# EasyEDA schematic 1-Schematic_Automatic watering v1.1.json
TITLE: Automatic Watering; REV: 1.1; Date: 2019-08-14; Sheet: 1/1; Drawn By: Tomáš Filo; Company: DIY
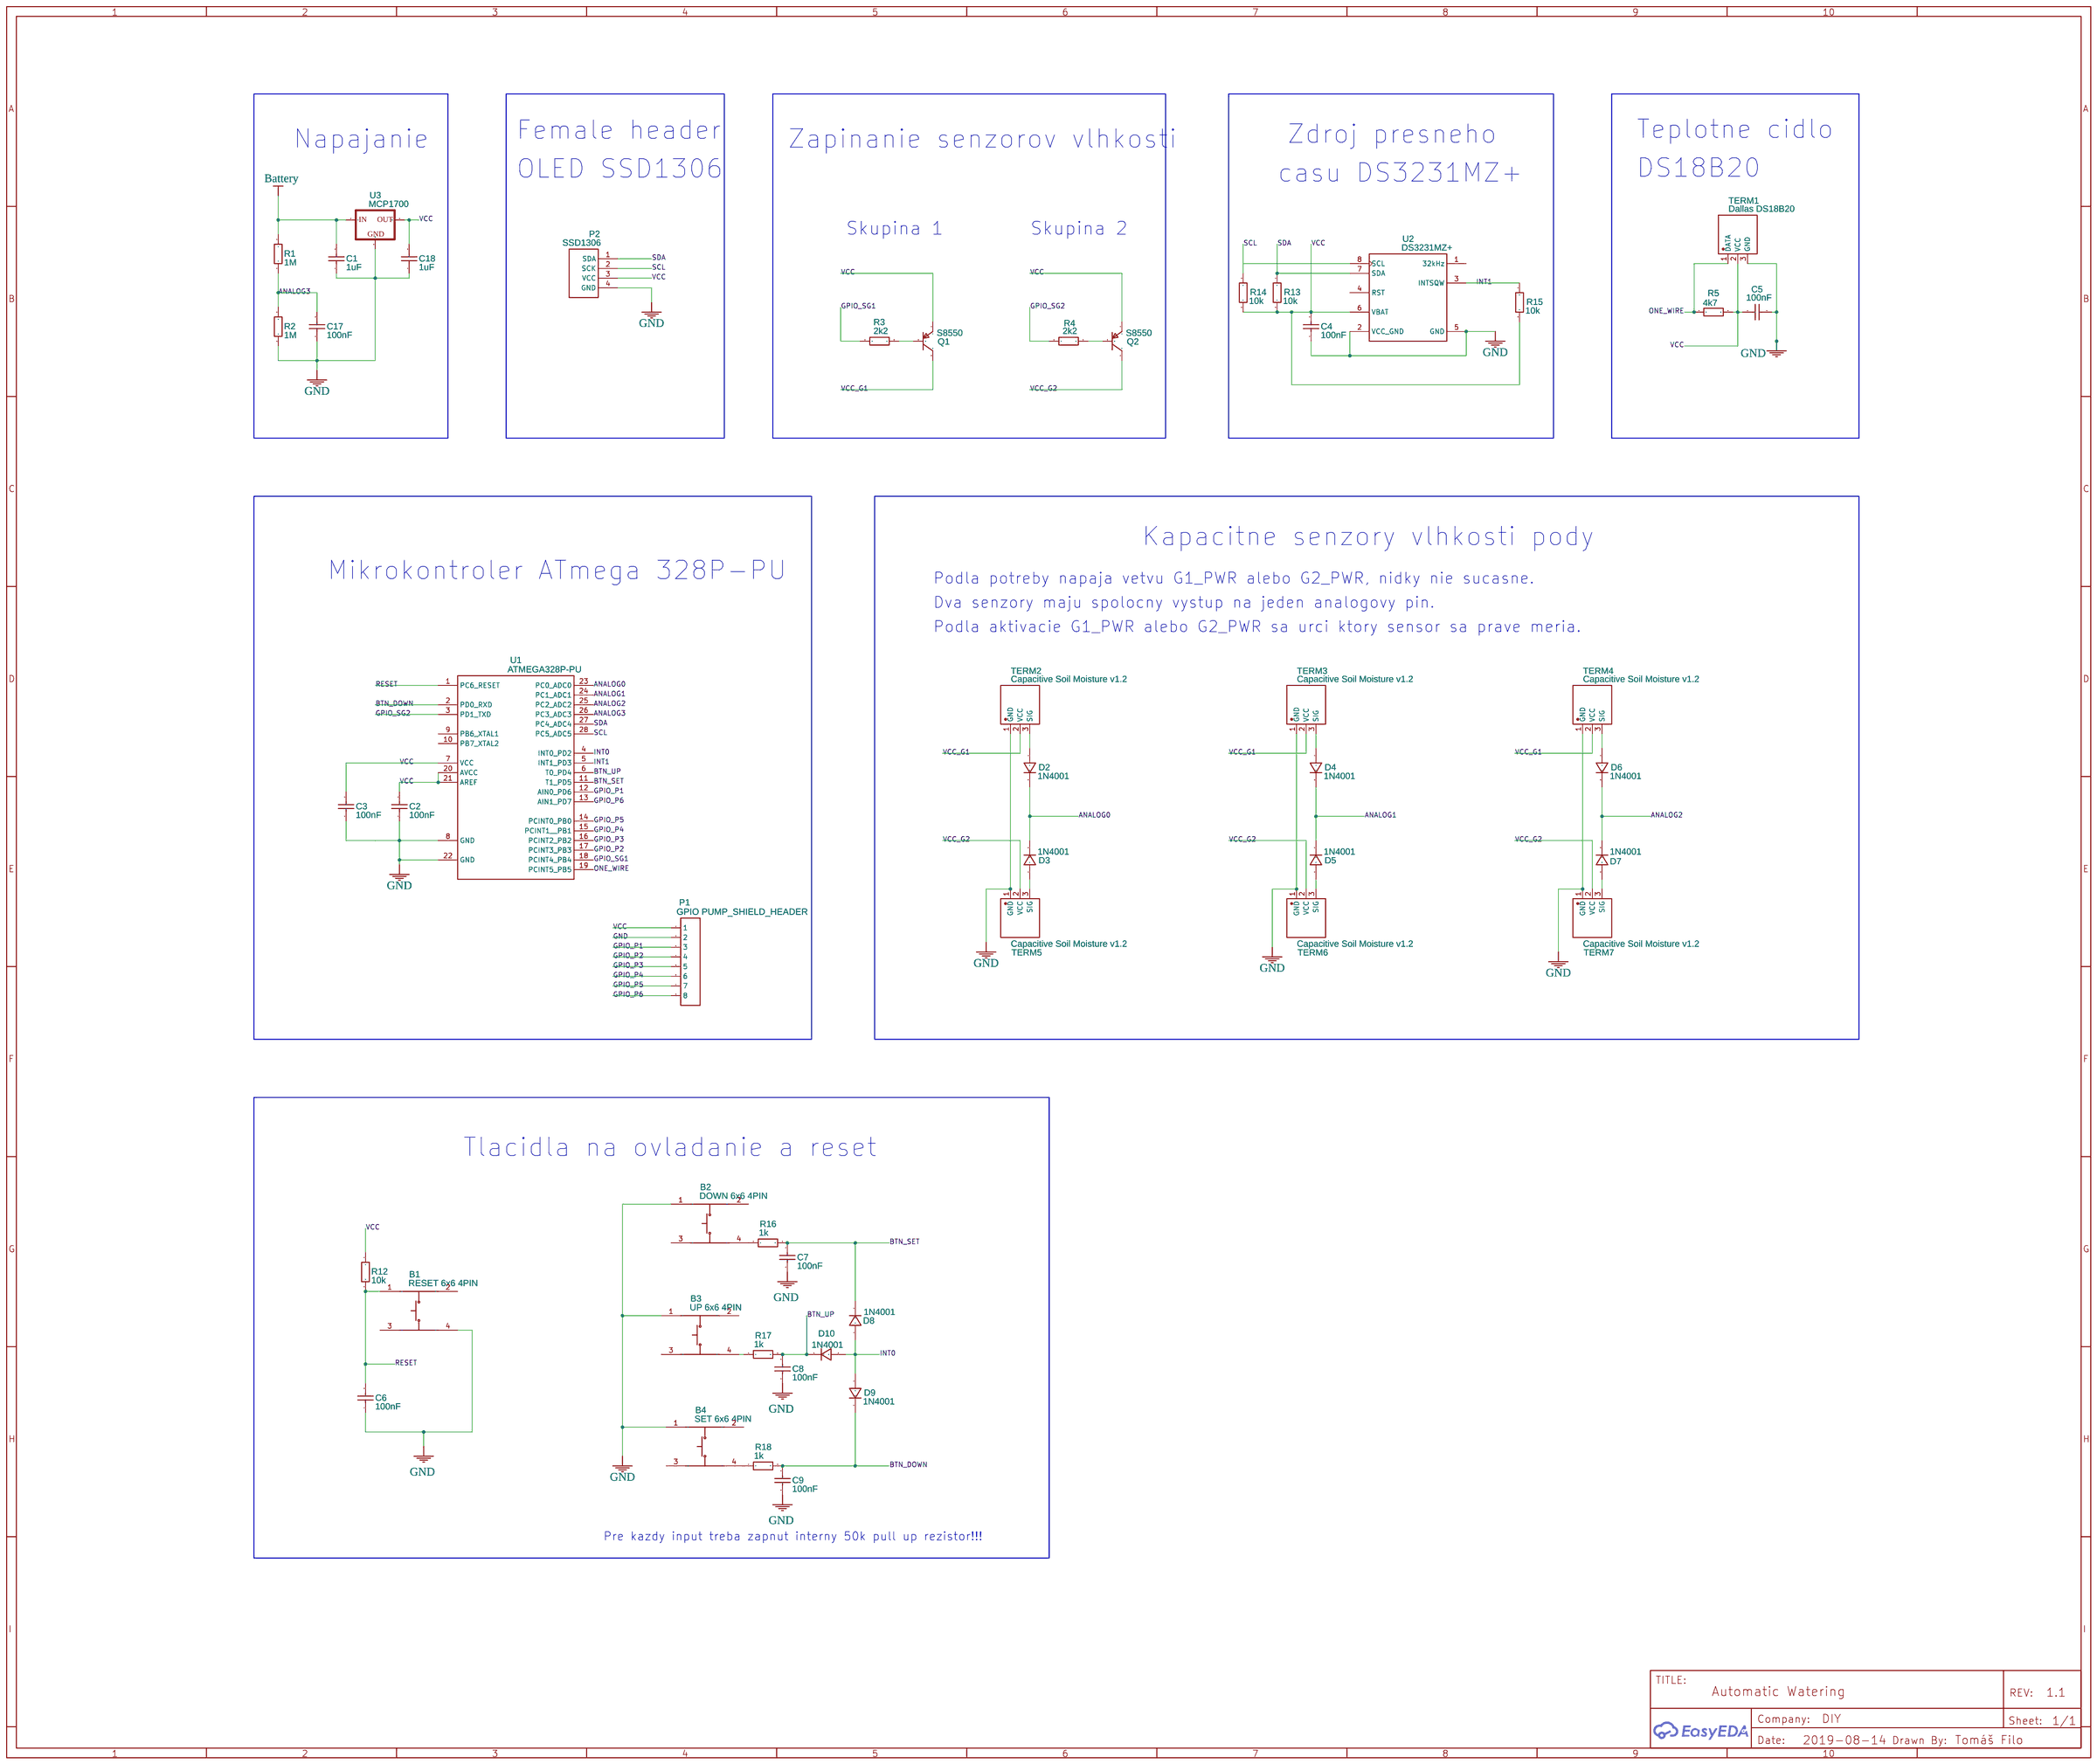
[diagram p0: schematic sheet]

## Parts
B1  RESET 6x6 4PIN  [SW-TH_4PIN-L6.00-W6.00]
B2  DOWN 6x6 4PIN  [SW-TH_4PIN-L6.00-W6.00]
B3  UP 6x6 4PIN  [SW-TH_4PIN-L6.00-W6.00]
B4  SET 6x6 4PIN  [SW-TH_4PIN-L6.00-W6.00]
C1  1uF  [CAP-0.2]
C2  100nF  [CAP-0.2]
C3  100nF  [CAP-0.2]
C4  100nF  [CAP-0.2]
C5  100nF  [CAP-0.2]
C6  100nF  [CAP-0.2]
C7  100nF  [CAP-0.2]
C8  100nF  [CAP-0.2]
C9  100nF  [CAP-0.2]
C17  100nF  [CAP-0.2]
C18  1uF  [CAP-0.2]
D2  1N4001  [DO-41]
D3  1N4001  [DO-41]
D4  1N4001  [DO-41]
D5  1N4001  [DO-41]
D6  1N4001  [DO-41]
D7  1N4001  [DO-41]
D8  1N4001  [DO-41]
D9  1N4001  [DO-41]
D10  1N4001  [DO-41]
P1  GPIO PUMP_SHIELD_HEADER  [HDR-8X1/2.54]
P2  SSD1306  [DIP-1X4P2.54]
Q1  S8550  [TO-92(TO-92-3)-2.54]
Q2  S8550  [TO-92(TO-92-3)-2.54]
R1  1M  [AXIAL-6.5X2.3(1/4W)]
R2  1M  [AXIAL-6.5X2.3(1/4W)]
R3  2k2  [AXIAL-6.5X2.3(1/4W)]
R4  2k2  [AXIAL-6.5X2.3(1/4W)]
R5  4k7  [AXIAL-6.5X2.3(1/4W)]
R12  10k  [AXIAL-6.5X2.3(1/4W)]
R13  10k  [AXIAL-6.5X2.3(1/4W)]
R14  10k  [AXIAL-6.5X2.3(1/4W)]
R15  10k  [AXIAL-6.5X2.3(1/4W)]
R16  1k  [AXIAL-6.5X2.3(1/4W)]
R17  1k  [AXIAL-6.5X2.3(1/4W)]
R18  1k  [AXIAL-6.5X2.3(1/4W)]
TERM1  Dallas DS18B20  [EK500V-03P]
TERM2  Capacitive Soil Moisture v1.2  [EK500V-03P]
TERM3  Capacitive Soil Moisture v1.2  [EK500V-03P]
TERM4  Capacitive Soil Moisture v1.2  [EK500V-03P]
TERM5  Capacitive Soil Moisture v1.2  [EK500V-03P]
TERM6  Capacitive Soil Moisture v1.2  [EK500V-03P]
TERM7  Capacitive Soil Moisture v1.2  [EK500V-03P]
U1  ATMEGA328P-PU  [DIP-28_300MIL]
U2  DS3231MZ+  [SOIC-8_150MIL]
U3  MCP1700  [TO92-INLINE]

## Library data of the parts
B1-B4 = -: Supplier: LCSC; Supplier Part: C381011; Manufacturer: XKB Enterprise; Manufacturer Part: TC-1102-C-E-B; Contributor: LCSC
C1-C9 C17 C18 = CD1H224KC9BER1E000: Supplier: LCSC; Supplier Part: C263191; Manufacturer: Dersonic; Contributor: LCSC
D2-D10 = -: Supplier Part: C169150; Supplier: LCSC; Manufacturer: DIOFIT; Contributor: LCSC
P1 = -: Supplier: LCSC; Manufacturer: BOOMELE; Manufacturer Part: Female headerHDR1X8-2.54; Supplier Part: C27438
P2 = -: Supplier: LCSC; Manufacturer: Ckmtw; Manufacturer Part: 220S-1*4P H=8.5MM Ytype Gold-plated; Contributor: LCSC; Supplier Part: C124413
Q1 Q2 = -: Supplier: LCSC; Supplier Part: C327518; Manufacturer: ON Semicon; Manufacturer Part: SS8550CTA; Contributor: LCSC
R1 R2 = MF1/4W-680Ω±1% T52: Supplier: LCSC; Supplier Part: C119320; Manufacturer: Chian Chia Elec; Contributor: LCSC
R3-R5 R12-R18 = MF1/4W-330Ω±1% T52: Supplier: LCSC; Supplier Part: C119313; Manufacturer: Chian Chia Elec; Contributor: LCSC
TERM1-TERM7 = -: Supplier: LCSC; Supplier Part: C182803; Manufacturer: Dinkle; Contributor: LCSC
U1 = -: sourceId: Oic6oiASL; Supplier: LCSC; Manufacturer: MICROCHIP; image: //image.lceda.cn/szlcsc/C33901.jpg; Contributor: LCSC; Supplier Part: C33901
U2 = -: Supplier: LCSC; Manufacturer: MAXIM; Supplier Part: C107410; LCSC Assembly: Yes; SMT Type: Extend
U3 = -: Contributor: Adafruit

## Nets
GND: B1.4 B2.1 B3.1 B4.1 C1.1 C2.1 C3.1 C4.1 C5.2 C6.1 C7.1 C8.1 C9.1 C17.1 C18.1 P1.2 P2.4(GND) R2.2 TERM1.3(GND) TERM2.1(GND) TERM3.1(GND) TERM4.1(GND) TERM5.1(GND) TERM6.1(GND) TERM7.1(GND) U1.8(GND) U1.22(GND) U2.2(VCC_GND) U2.5(GND) U3.1(GND)
VCC: C2.2 C3.2 C4.2 C5.1 C18.2 P1.1 P2.3(VCC) Q1.1(E) Q2.1(E) R5.2 R12.1 R13.2 R14.2 R15.2 TERM1.2(VCC) U1.7(VCC) U1.20(AVCC) U1.21(AREF) U2.6(VBAT) U3.3(OUT)
VCC_G1: Q1.3(C) TERM2.2(VCC) TERM3.2(VCC) TERM4.2(VCC)
VCC_G2: Q2.3(C) TERM5.2(VCC) TERM6.2(VCC) TERM7.2(VCC)
ANALOG0: D2.2 D3.2 U1.23(PC0 ADC0)
ANALOG1: D4.2 D5.2 U1.24(PC1 ADC1)
ANALOG2: D6.2 D7.2 U1.25(PC2 ADC2)
ANALOG3: C17.2 R1.2 R2.1 U1.26(PC3 ADC3)
Battery: C1.2 R1.1 U3.2(IN)
BTN_DOWN: C9.2 D9.2 R18.2 U1.2(PD0 RXD)
BTN_SET: C7.2 D8.2 R16.2 U1.11(T1 PD5)
BTN_UP: C8.2 D10.2 R17.2 U1.6(T0 PD4)
GPIO_P1: P1.3 U1.12(AIN0 PD6)
GPIO_P2: P1.4 U1.17(PCINT3 PB3)
GPIO_P3: P1.5 U1.16(PCINT2 PB2)
GPIO_P4: P1.6 U1.15(PCINT1  PB1)
GPIO_P5: P1.7 U1.14(PCINT0 PB0)
GPIO_P6: P1.8 U1.13(AIN1 PD7)
GPIO_SG1: R3.1 U1.18(PCINT4 PB4)
GPIO_SG2: R4.1 U1.3(PD1 TXD)
INT0: D8.1 D9.1 D10.1 U1.4(INT0 PD2)
INT1: R15.1 U1.5(INT1 PD3) U2.3(INTSQW)
ONE_WIRE: R5.1 TERM1.1(DATA) U1.19(PCINT5 PB5)
RESET: B1.1 C6.2 R12.2 U1.1(PC6 RESET)
SCL: P2.2(SCK) R14.1 U1.28(PC5 ADC5) U2.8(SCL)
SDA: P2.1(SDA) R13.1 U1.27(PC4 ADC4) U2.7(SDA)
Net-(B2-4): B2.4 R16.1
Net-(B3-4): B3.4 R17.1
Net-(B4-4): B4.4 R18.1
Net-(D2-1): D2.1 TERM2.3(SIG)
Net-(D3-1): D3.1 TERM5.3(SIG)
Net-(D4-1): D4.1 TERM3.3(SIG)
Net-(D5-1): D5.1 TERM6.3(SIG)
Net-(D6-1): D6.1 TERM4.3(SIG)
Net-(D7-1): D7.1 TERM7.3(SIG)
Net-(Q1-2): Q1.2(B) R3.2
Net-(Q2-2): Q2.2(B) R4.2

Not connected (* = marked no-connect by the designer): B1 2 3; B2 2 3; B3 2 3; B4 2 3; U1 9(PB6 XTAL1) 10(PB7 XTAL2); U2 1(32kHz) 4(RST)

## Notes on the sheet
- Female header
- Zdroj presneho
- Teplotne cidlo
- Napajanie
- Zapinanie senzorov vlhkosti
- OLED SSD1306
- DS18B20
- casu DS3231MZ+
- Skupina 1
- Skupina 2
- Kapacitne senzory vlhkosti pody
- Mikrokontroler ATmega 328P-PU
- Podla potreby napaja vetvu G1_PWR alebo G2_PWR, nidky nie sucasne.
- Dva senzory maju spolocny vystup na jeden analogovy pin.
- Podla aktivacie G1_PWR alebo G2_PWR sa urci ktory sensor sa prave meria.
- Tlacidla na ovladanie a reset
- Pre kazdy input treba zapnut interny 50k pull up rezistor!!!
